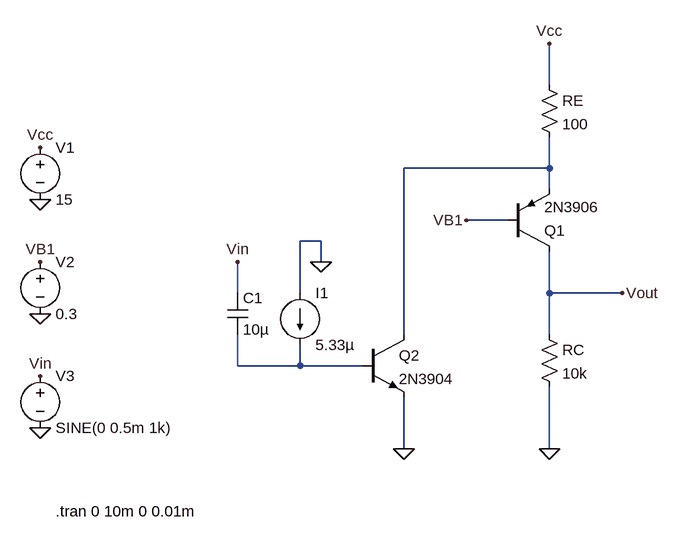
[diagram p0: schematic folded_cascode_amplifier.asc]
folded_cascode_amplifier.asc, the LTspice schematic file:
Version 4.1
SHEET 1 1140 680
WIRE 864 -160 864 -224
WIRE 864 -32 864 -80
WIRE 864 -32 640 -32
WIRE 864 0 864 -32
WIRE 800 48 736 48
WIRE 512 80 480 80
WIRE 512 112 512 80
WIRE 384 160 384 112
WIRE 480 160 480 80
WIRE 864 160 864 96
WIRE 976 160 864 160
WIRE 640 224 640 -32
WIRE 864 224 864 160
WIRE 384 272 384 224
WIRE 480 272 480 240
WIRE 480 272 384 272
WIRE 576 272 480 272
WIRE 640 400 640 320
WIRE 864 400 864 304
FLAG 80 368 0
FLAG 80 192 0
FLAG 80 16 0
FLAG 512 112 0
FLAG 640 400 0
FLAG 864 400 0
FLAG 864 -224 Vcc
FLAG 80 -64 Vcc
FLAG 736 48 VB1
FLAG 80 112 VB1
FLAG 80 288 Vin
FLAG 384 112 Vin
FLAG 976 160 Vout
SYMBOL voltage 80 -80 R0
WINDOW 123 0 0 Left 0
WINDOW 39 0 0 Left 0
SYMATTR InstName V1
SYMATTR Value 15
SYMBOL voltage 80 96 R0
WINDOW 123 0 0 Left 0
WINDOW 39 0 0 Left 0
SYMATTR InstName V2
SYMATTR Value 0.3
SYMBOL voltage 80 272 R0
WINDOW 123 0 0 Left 0
WINDOW 39 0 0 Left 0
SYMATTR InstName V3
SYMATTR Value SINE(0 0.5m 1k)
SYMBOL current 480 160 R0
WINDOW 123 0 0 Left 0
WINDOW 39 0 0 Left 0
SYMATTR InstName I1
SYMATTR Value 5.33µ
SYMBOL npn 576 224 R0
SYMATTR InstName Q2
SYMATTR Value 2N3904
SYMBOL cap 368 160 R0
SYMATTR InstName C1
SYMATTR Value 10µ
SYMBOL res 848 208 R0
SYMATTR InstName RC
SYMATTR Value 10k
SYMBOL res 848 -176 R0
SYMATTR InstName RE
SYMATTR Value 100
SYMBOL pnp 800 96 M180
SYMATTR InstName Q1
SYMATTR Value 2N3906
TEXT 104 496 Left 2 !.tran 0 10m 0 0.01m

The netlist it stands for:
* folded_cascode_amplifier.asc
V1 Vcc 0 15
V2 VB1 0 0.3
V3 Vin 0 SINE(0 0.5m 1k)
I1 0 N002 5.33µ
Q2 N001 N002 0 0 2N3904
C1 Vin N002 10µ
RC Vout 0 10k
RE Vcc N001 100
Q1 Vout VB1 N001 0 2N3906
.model NPN NPN
.model PNP PNP
.lib standard.bjt
.tran 0 10m 0 0.01m
.backanno
.end